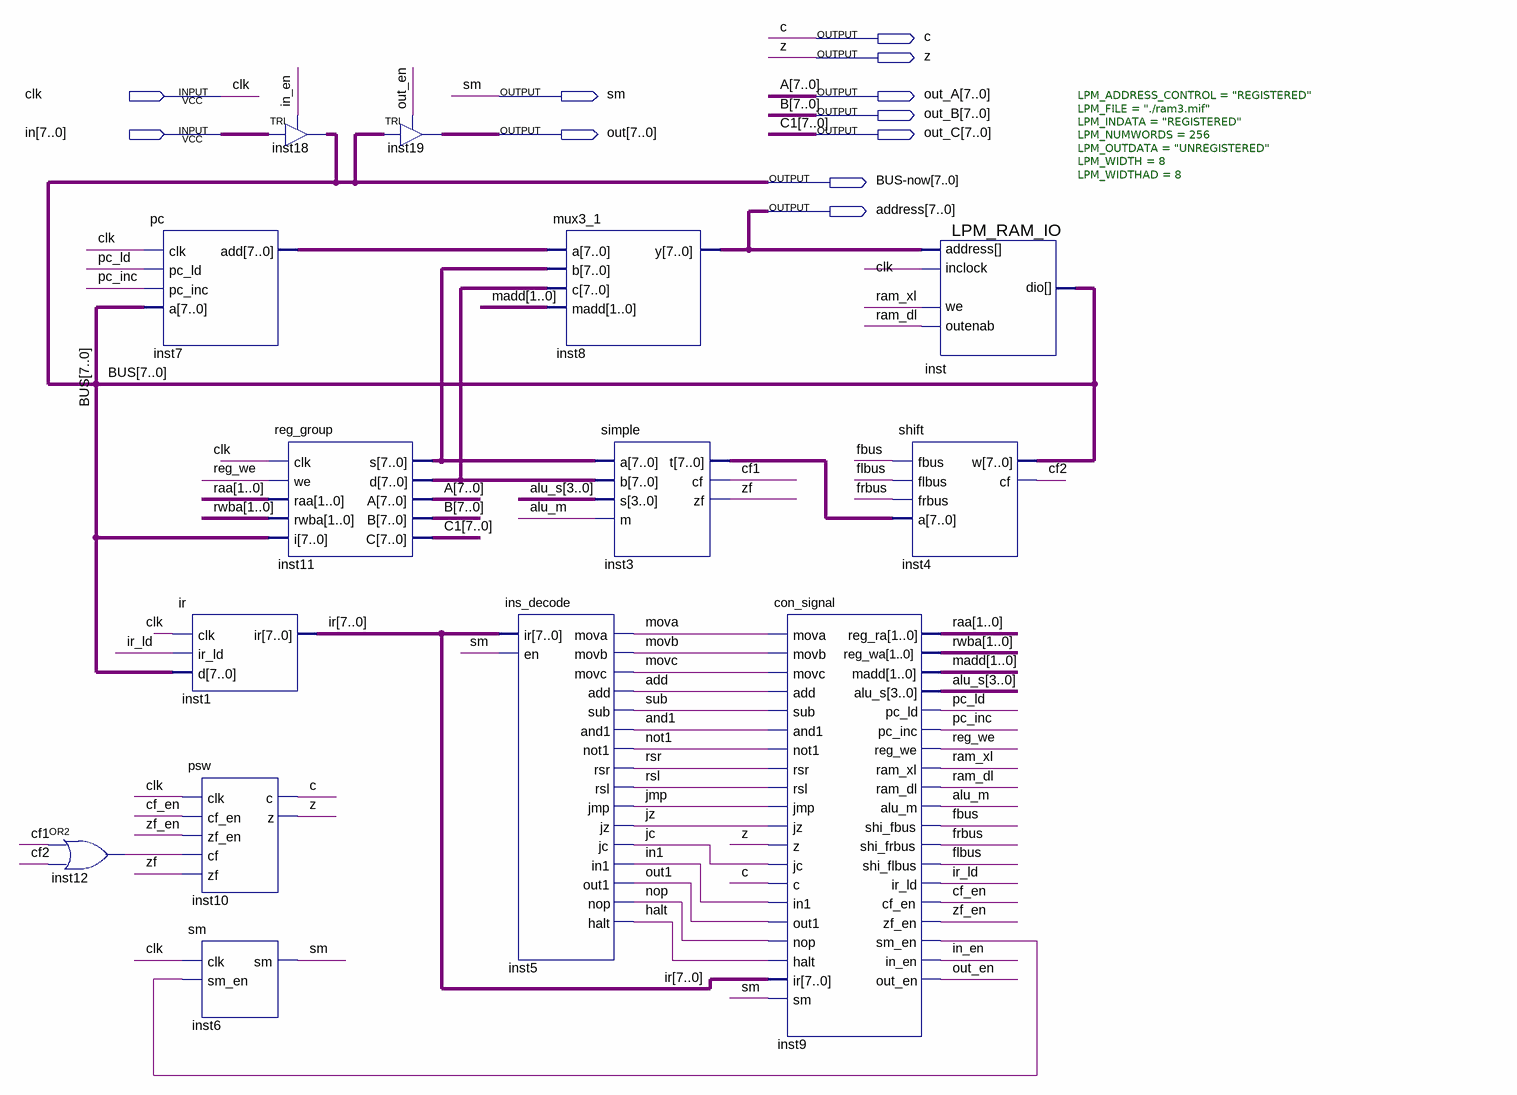
[diagram p0: schematic sheet]
// Quartus schematic small_computer.bdf as structural Verilog: 14 symbols, 11 pins
module small_computer (
  input  clk,
  input  [7:0] in,
  output c,
  output z,
  output sm,
  output [7:0] out_A,
  output [7:0] out_B,
  output [7:0] out,
  output [7:0] out_C,
  output [7:0] \BUS-now ,
  output [7:0] address
);

  wire add, alu_m, and1, cf1, cf2, cf_en, fbus, flbus, frbus, halt, in_en, inst9_sm_en, inst12_out, ir_ld,
       jc, jmp, jz, mova, movb, movc, nop, not1, out_en, pc_inc, pc_ld, ram_dl, ram_xl, reg_we, rsl, rsr,
       sub, zf, zf_en;
  wire [1:0] madd, raa, rwba;
  wire [3:0] alu_s;
  wire [7:0] inst3_t, inst7_add, inst11_d, inst11_s, ir;

  or inst12 (inst12_out, cf1, cf2);
  pc inst7 (.clk(clk), .pc_ld(pc_ld), .pc_inc(pc_inc), .a(\BUS-now ), .add(inst7_add));
  ir inst1 (.clk(clk), .ir_ld(ir_ld), .d(\BUS-now ), .ir(ir));
  psw inst10 (.clk(clk), .cf_en(cf_en), .zf_en(zf_en), .cf(inst12_out), .zf(zf), .c(c), .z(z));
  sm inst6 (.clk(clk), .sm_en(inst9_sm_en), .sm(sm));
  TRI inst18[7:0] (.IN(in), .OE(in_en), .OUT(\BUS-now ));
  reg_group inst11 (
    .clk(clk), .we(reg_we), .raa(raa), .rwba(rwba), .i(\BUS-now ), .s(inst11_s), .d(inst11_d), .A(out_A),
    .B(out_B), .C(out_C));
  TRI inst19[7:0] (.IN(\BUS-now ), .OE(out_en), .OUT(out));
  ins_decode inst5 (
    .ir(ir), .en(sm), .mova(mova), .movb(movb), .movc(movc), .add(add), .sub(sub), .and1(and1), .not1(not1),
    .rsr(rsr), .rsl(rsl), .jmp(jmp), .jz(jz), .jc(jc), .in1(in[1]), .out1(out[1]), .nop(nop), .halt(halt));
  mux3_1 inst8 (.a(inst7_add), .b(inst11_s), .c(inst11_d), .madd(madd), .y(address));
  simple inst3 (.a(inst11_s), .b(inst11_d), .s(alu_s), .m(alu_m), .t(inst3_t), .cf(cf1), .zf(zf));
  con_signal inst9 (
    .mova(mova), .movb(movb), .movc(movc), .add(add), .sub(sub), .and1(and1), .not1(not1), .rsr(rsr),
    .rsl(rsl), .jmp(jmp), .jz(jz), .z(z), .jc(jc), .c(c), .in1(in[1]), .out1(out[1]), .nop(nop), .halt(halt),
    .ir(ir), .sm(sm), .reg_ra(raa), .reg_wa(rwba), .madd(madd), .alu_s(alu_s), .pc_ld(pc_ld),
    .pc_inc(pc_inc), .reg_we(reg_we), .ram_xl(ram_xl), .ram_dl(ram_dl), .alu_m(alu_m), .shi_fbus(fbus),
    .shi_frbus(frbus), .shi_flbus(flbus), .ir_ld(ir_ld), .cf_en(cf_en), .zf_en(zf_en), .sm_en(inst9_sm_en),
    .in_en(in_en), .out_en(out_en));
  shift inst4 (.fbus(fbus), .flbus(flbus), .frbus(frbus), .a(inst3_t), .w(\BUS-now ), .cf(cf2));
  LPM_RAM_IO #(.LPM_ADDRESS_CONTROL("REGISTERED"), .LPM_FILE("./ram3.mif"), .LPM_INDATA("REGISTERED"), .LPM_NUMWORDS(256), .LPM_OUTDATA("UNREGISTERED"), .LPM_WIDTH(8), .LPM_WIDTHAD(8)) inst (
    .address(address), .inclock(clk), .we(ram_xl), .outenab(ram_dl), .dio(\BUS-now ));

  // Other names for the same wires on the sheet: A[7:0] = out_A; B[7:0] = out_B; BUS[7:0] = \BUS-now ;
  //   C1[7:0] = out_C
endmodule
